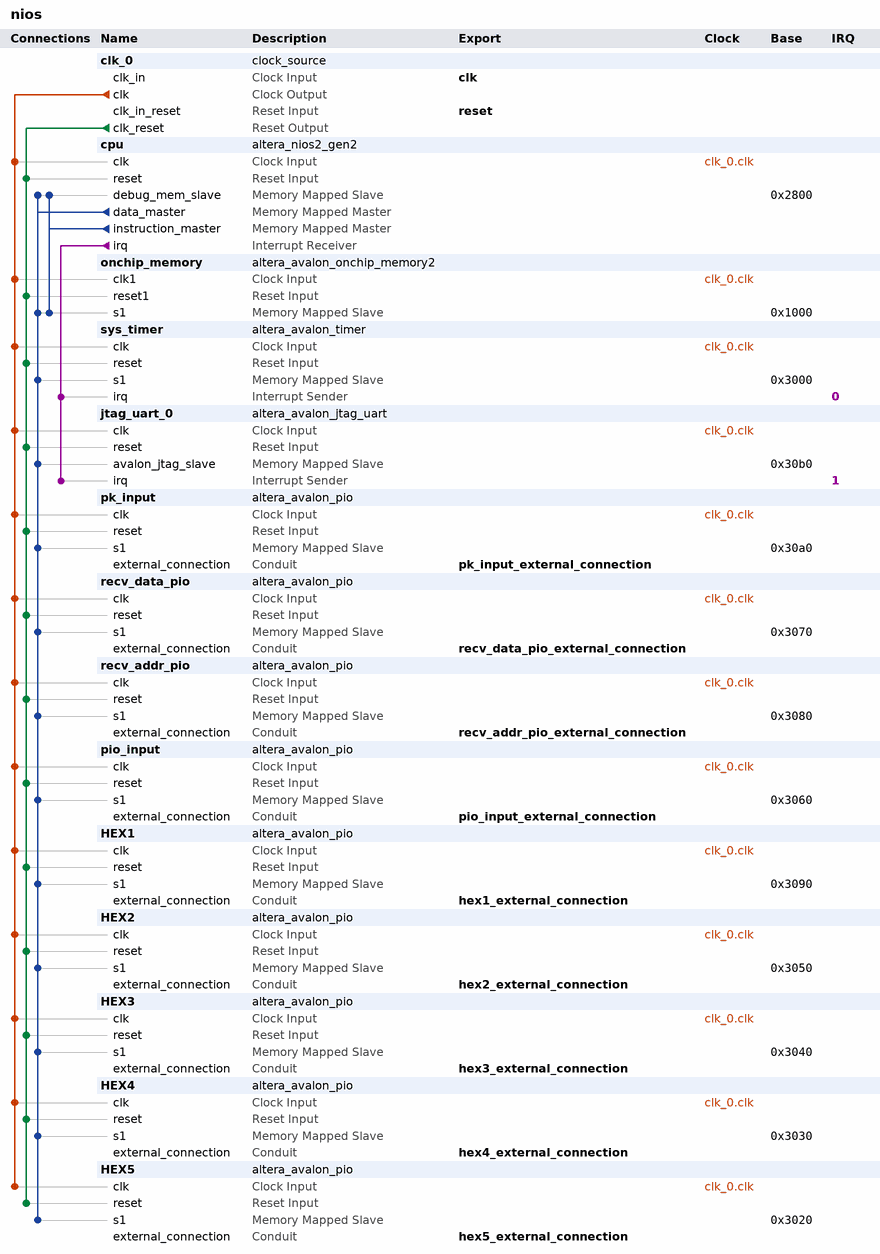
[diagram p0: system contents]
# Platform Designer (Qsys) system nios, Cyclone V 5CSEMA5F31C6
# Parameters at their usual value, and those the tool derives, are not listed.
package require -exact qsys 18.1
create_system nios
set_project_property DEVICE_FAMILY {Cyclone V}
set_project_property DEVICE 5CSEMA5F31C6

add_instance clk_0 clock_source 18.1
set_instance_parameter_value clk_0 clockFrequency 50000000

add_instance cpu altera_nios2_gen2 18.1
set_instance_parameter_value cpu cpuID 1
set_instance_parameter_value cpu dcache_size 2048
set_instance_parameter_value cpu exceptionSlave onchip_memory.s1
set_instance_parameter_value cpu icache_size 4096
set_instance_parameter_value cpu impl Fast
set_instance_parameter_value cpu resetSlave onchip_memory.s1

add_instance onchip_memory altera_avalon_onchip_memory2 18.1
set_instance_parameter_value onchip_memory dataWidth 32
set_instance_parameter_value onchip_memory dualPort false
set_instance_parameter_value onchip_memory initMemContent true
set_instance_parameter_value onchip_memory initializationFileName onchip_mem.hex
set_instance_parameter_value onchip_memory memorySize 4096

add_instance sys_timer altera_avalon_timer 18.1
set_instance_parameter_value sys_timer period 1
set_instance_parameter_value sys_timer periodUnits MSEC

add_instance jtag_uart_0 altera_avalon_jtag_uart 18.1
set_instance_parameter_value jtag_uart_0 simInteractiveOptions NO_INTERACTIVE_WINDOWS

add_instance pk_input altera_avalon_pio 18.1
set_instance_parameter_value pk_input direction Input
set_instance_parameter_value pk_input width 1

add_instance recv_data_pio altera_avalon_pio 18.1
set_instance_parameter_value recv_data_pio direction Input
set_instance_parameter_value recv_data_pio width 32

add_instance recv_addr_pio altera_avalon_pio 18.1
set_instance_parameter_value recv_addr_pio direction Output
set_instance_parameter_value recv_addr_pio width 8

add_instance pio_input altera_avalon_pio 18.1
set_instance_parameter_value pio_input direction Output
set_instance_parameter_value pio_input width 32

add_instance HEX1 altera_avalon_pio 18.1
set_instance_parameter_value HEX1 direction Output
set_instance_parameter_value HEX1 width 7

add_instance HEX2 altera_avalon_pio 18.1
set_instance_parameter_value HEX2 direction Output
set_instance_parameter_value HEX2 width 7

add_instance HEX3 altera_avalon_pio 18.1
set_instance_parameter_value HEX3 direction Output
set_instance_parameter_value HEX3 width 7

add_instance HEX4 altera_avalon_pio 18.1
set_instance_parameter_value HEX4 direction Output
set_instance_parameter_value HEX4 width 7

add_instance HEX5 altera_avalon_pio 18.1
set_instance_parameter_value HEX5 direction Output
set_instance_parameter_value HEX5 width 7

# connections
add_connection clk_0.clk cpu.clk clock
add_connection clk_0.clk HEX1.clk clock
add_connection clk_0.clk HEX2.clk clock
add_connection clk_0.clk HEX3.clk clock
add_connection clk_0.clk HEX4.clk clock
add_connection clk_0.clk HEX5.clk clock
add_connection clk_0.clk jtag_uart_0.clk clock
add_connection clk_0.clk onchip_memory.clk1 clock
add_connection clk_0.clk pio_input.clk clock
add_connection clk_0.clk pk_input.clk clock
add_connection clk_0.clk recv_addr_pio.clk clock
add_connection clk_0.clk recv_data_pio.clk clock
add_connection clk_0.clk sys_timer.clk clock
add_connection clk_0.clk_reset cpu.reset reset
add_connection clk_0.clk_reset HEX1.reset reset
add_connection clk_0.clk_reset HEX2.reset reset
add_connection clk_0.clk_reset HEX3.reset reset
add_connection clk_0.clk_reset HEX4.reset reset
add_connection clk_0.clk_reset HEX5.reset reset
add_connection clk_0.clk_reset jtag_uart_0.reset reset
add_connection clk_0.clk_reset onchip_memory.reset1 reset
add_connection clk_0.clk_reset pio_input.reset reset
add_connection clk_0.clk_reset pk_input.reset reset
add_connection clk_0.clk_reset recv_addr_pio.reset reset
add_connection clk_0.clk_reset recv_data_pio.reset reset
add_connection clk_0.clk_reset sys_timer.reset reset
add_connection cpu.data_master cpu.debug_mem_slave avalon
set_connection_parameter_value cpu.data_master/cpu.debug_mem_slave baseAddress 0x2800
add_connection cpu.data_master HEX1.s1 avalon
set_connection_parameter_value cpu.data_master/HEX1.s1 baseAddress 0x3090
add_connection cpu.data_master HEX2.s1 avalon
set_connection_parameter_value cpu.data_master/HEX2.s1 baseAddress 0x3050
add_connection cpu.data_master HEX3.s1 avalon
set_connection_parameter_value cpu.data_master/HEX3.s1 baseAddress 0x3040
add_connection cpu.data_master HEX4.s1 avalon
set_connection_parameter_value cpu.data_master/HEX4.s1 baseAddress 0x3030
add_connection cpu.data_master HEX5.s1 avalon
set_connection_parameter_value cpu.data_master/HEX5.s1 baseAddress 0x3020
add_connection cpu.data_master jtag_uart_0.avalon_jtag_slave avalon
set_connection_parameter_value cpu.data_master/jtag_uart_0.avalon_jtag_slave baseAddress 0x30b0
add_connection cpu.data_master onchip_memory.s1 avalon
set_connection_parameter_value cpu.data_master/onchip_memory.s1 baseAddress 0x1000
add_connection cpu.data_master pio_input.s1 avalon
set_connection_parameter_value cpu.data_master/pio_input.s1 baseAddress 0x3060
add_connection cpu.data_master pk_input.s1 avalon
set_connection_parameter_value cpu.data_master/pk_input.s1 baseAddress 0x30a0
add_connection cpu.data_master recv_addr_pio.s1 avalon
set_connection_parameter_value cpu.data_master/recv_addr_pio.s1 baseAddress 0x3080
add_connection cpu.data_master recv_data_pio.s1 avalon
set_connection_parameter_value cpu.data_master/recv_data_pio.s1 baseAddress 0x3070
add_connection cpu.data_master sys_timer.s1 avalon
set_connection_parameter_value cpu.data_master/sys_timer.s1 baseAddress 0x3000
add_connection cpu.instruction_master cpu.debug_mem_slave avalon
set_connection_parameter_value cpu.instruction_master/cpu.debug_mem_slave baseAddress 0x2800
add_connection cpu.instruction_master onchip_memory.s1 avalon
set_connection_parameter_value cpu.instruction_master/onchip_memory.s1 baseAddress 0x1000
add_connection cpu.irq jtag_uart_0.irq interrupt
set_connection_parameter_value cpu.irq/jtag_uart_0.irq irqNumber 1
add_connection cpu.irq sys_timer.irq interrupt
set_connection_parameter_value cpu.irq/sys_timer.irq irqNumber 0

# exported interfaces
add_interface clk clock sink
set_interface_property clk EXPORT_OF clk_0.clk_in
add_interface hex1_external_connection conduit end
set_interface_property hex1_external_connection EXPORT_OF HEX1.external_connection
add_interface hex2_external_connection conduit end
set_interface_property hex2_external_connection EXPORT_OF HEX2.external_connection
add_interface hex3_external_connection conduit end
set_interface_property hex3_external_connection EXPORT_OF HEX3.external_connection
add_interface hex4_external_connection conduit end
set_interface_property hex4_external_connection EXPORT_OF HEX4.external_connection
add_interface hex5_external_connection conduit end
set_interface_property hex5_external_connection EXPORT_OF HEX5.external_connection
add_interface pio_input_external_connection conduit end
set_interface_property pio_input_external_connection EXPORT_OF pio_input.external_connection
add_interface pk_input_external_connection conduit end
set_interface_property pk_input_external_connection EXPORT_OF pk_input.external_connection
add_interface recv_addr_pio_external_connection conduit end
set_interface_property recv_addr_pio_external_connection EXPORT_OF recv_addr_pio.external_connection
add_interface recv_data_pio_external_connection conduit end
set_interface_property recv_data_pio_external_connection EXPORT_OF recv_data_pio.external_connection
add_interface reset reset sink
set_interface_property reset EXPORT_OF clk_0.clk_in_reset

set_interconnect_requirement {$system} qsys_mm.clockCrossingAdapter HANDSHAKE
set_interconnect_requirement {$system} qsys_mm.enableEccProtection FALSE
set_interconnect_requirement {$system} qsys_mm.insertDefaultSlave FALSE
set_interconnect_requirement {$system} qsys_mm.maxAdditionalLatency 1

save_system nios.qsys
